# Altium schematic sheet GNSS_A.SchDoc
size A4; SheetNumber: 3; SheetTotal: 7
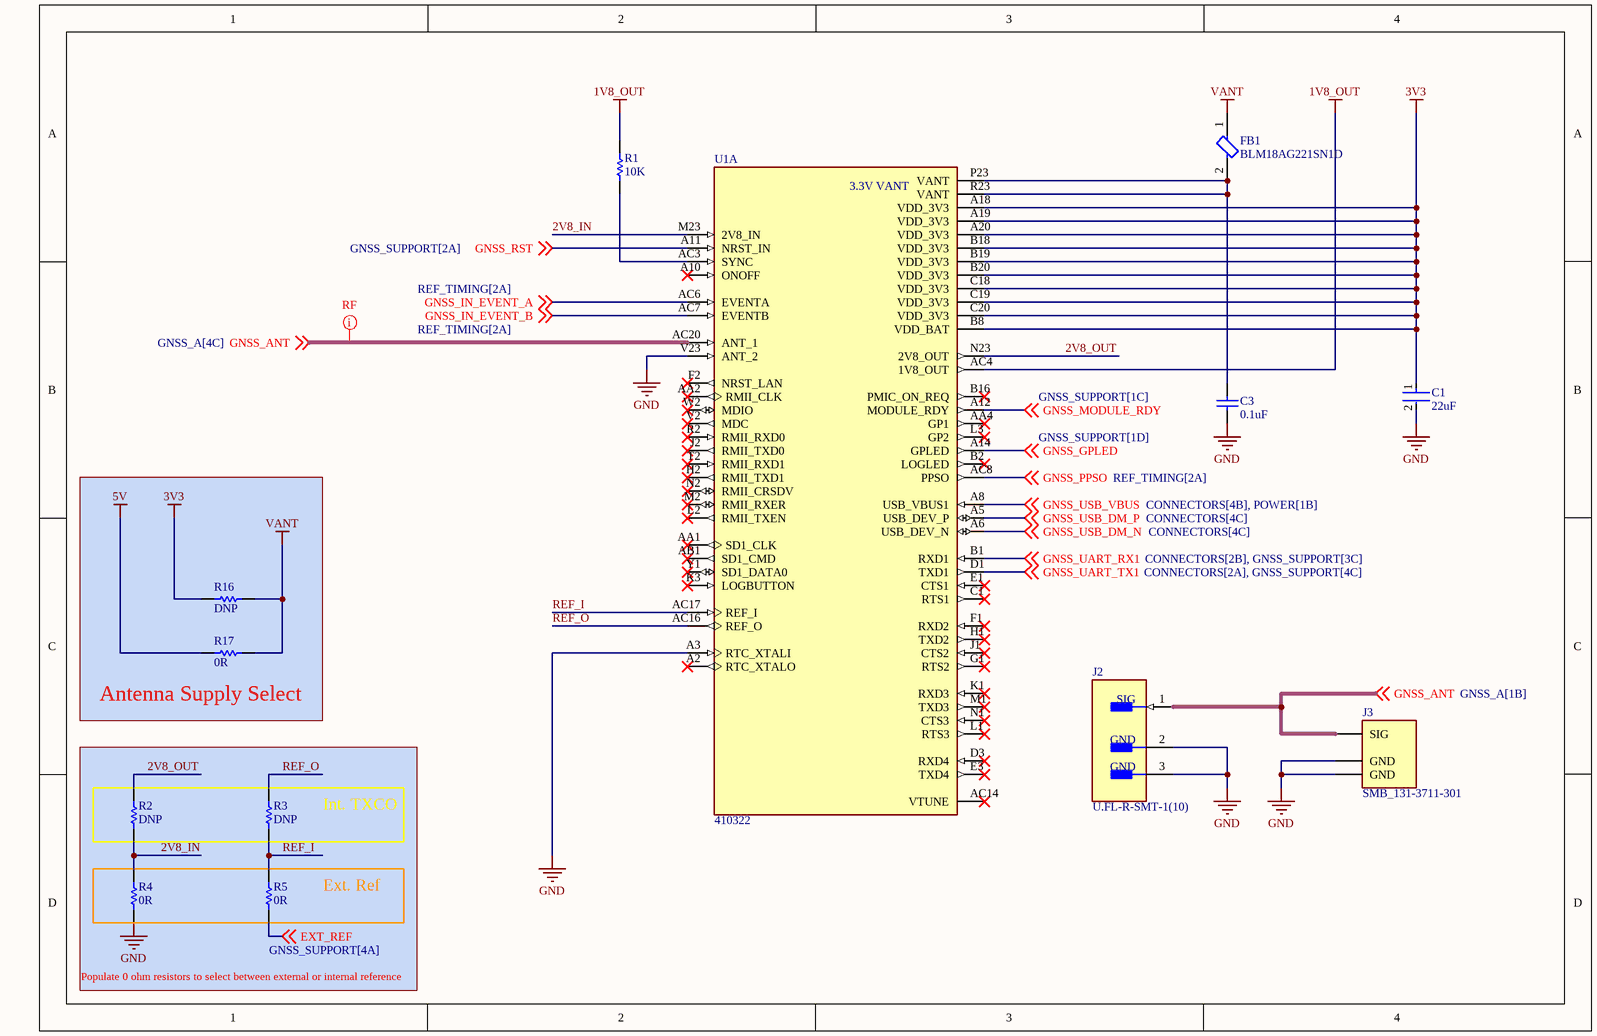
[diagram p0: GNSS_A.SchDoc]

## Parts
C1  22uF  [FP-CL10-IPC_B]
C3  0.1uF  [CAPC1005X56X25LL10T15]
FB1  BLM18AG221SN1D  [FP-BLM18-0_15-t0_8-IPC_A]
J2  U.FL-R-SMT-1(10)  [FP-U_FL-R-SMT-1_10-MFG]
J3  SMB_131-3711-301  [SMB_131-3711-301]
R1  10K  [RESC1005X40X25LL05T10]
R2  DNP  [RESC1005X40X25NL05T10]
R3  DNP  [RESC1005X40X25NL05T10]
R4  0R  [RESC1005X40X25NL05T10]
R5  0R  [RESC1005X40X25NL05T10]
R16  DNP  [RESC1005X40X25NL05T10]
R17  0R  [RESC1005X40X25NL05T10]
U1  410322  [LGA239C127P23X23_3100X3100X417N]  (part A of 3)

## Blocks framed on the sheet
Antenna Supply Select: R16 R17
Int. TXCO: R2 R3
Ext. Ref: R4 R5

## Nets
1V8_OUT: R1.2 U1.AC4(1V8_OUT)
3V3: C1.1 R16.1 U1.A18(VDD_3V3) U1.A19(VDD_3V3) U1.A20(VDD_3V3) U1.B8(VDD_BAT) U1.B18(VDD_3V3) U1.B19(VDD_3V3) U1.B20(VDD_3V3) U1.C18(VDD_3V3) U1.C19(VDD_3V3) U1.C20(VDD_3V3)
5V: R17.1
GND: C1.2 C3.1 J2.2(GND) J2.3(GND) J3.2(GND) J3.3(GND) R4.2 U1.A3(RTC_XTALI) U1.V23(ANT_2)
VANT: FB1.1 R16.2 R17.2
2V8_IN: R2.2 R4.1 U1.M23(2V8_IN)
2V8_OUT: R2.1 U1.N23(2V8_OUT)
EXT_REF: R5.2 ; off-sheet EXT_REF
GNSS_ANT: J2.1(SIG) J3.1(SIG) U1.AC20(ANT_1) ; off-sheet GNSS_ANT
GNSS_GPLED: U1.A14(GPLED) ; off-sheet GNSS_GPLED
GNSS_IN_EVENT_A: U1.AC6(EVENTA) ; off-sheet GNSS_IN_EVENT_A
GNSS_IN_EVENT_B: U1.AC7(EVENTB) ; off-sheet GNSS_IN_EVENT_B
GNSS_MODULE_RDY: U1.A12(MODULE_RDY) ; off-sheet GNSS_MODULE_RDY
GNSS_PPSO: U1.AC8(PPSO) ; off-sheet GNSS_PPSO
GNSS_RST: U1.A11(NRST_IN) ; off-sheet GNSS_RST
GNSS_UART_RX1: U1.B1(RXD1) ; off-sheet GNSS_UART_RX1
GNSS_UART_TX1: U1.D1(TXD1) ; off-sheet GNSS_UART_TX1
GNSS_USB_DM_N: U1.A6(USB_DEV_N) ; off-sheet GNSS_USB_DM_N
GNSS_USB_DM_P: U1.A5(USB_DEV_P) ; off-sheet GNSS_USB_DM_P
GNSS_USB_VBUS: U1.A8(USB_VBUS1) ; off-sheet GNSS_USB_VBUS
REF_I: R3.2 R5.1 U1.AC17(REF_I)
REF_O: R3.1 U1.AC16(REF_O)
NetC3_2: C3.2 FB1.2 U1.P23(VANT) U1.R23(VANT)
NetR1_1: R1.1 U1.AC3(SYNC)

Not connected (* = marked no-connect by the designer): U1 A2(RTC_XTALO)* A10(ONOFF)* AA1(SD1_CLK)* AA2(RMII_CLK)* AA4(GP1)* AB1(SD1_CMD)* AC14(VTUNE)* B2(LOGLED)* B16(PMIC_ON_REQ)* C1(RTS1)* D3(RXD4)* E1(CTS1)* E3(TXD4)* F1(RXD2)* F2(NRST_LAN)* G1(RTS2)* H1(TXD2)* H2(RMII_TXD1)* J1(CTS2)* J2(RMII_TXD0)* K1(RXD3)* K3(LOGBUTTON)* L1(RTS3)* L2(RMII_TXEN)* L3(GP2)* M1(TXD3)* M2(RMII_RXER)* N1(CTS3)* N2(RMII_CRSDV)* R2(RMII_RXD0)* T2(RMII_RXD1)* V2(MDC)* W2(MDIO)* Y1(SD1_DATA0)*

## Layout directives
net class RF: GNSS_ANT

## Notes on the sheet
- (near U1) 3.3V VANT
- Populate 0 ohm resistors to select between external or internal reference

## Library data of the parts
C1 = CMP-13271-003290-1: Cap Ceramic 22uF 10V X5R ±20% Pad SMD 0603 +85°C T/R; Max Operating Temperature: 85°C; Packaging: Tape and Reel; Mount: Surface Mount; Width: 0.031inch; Length: 0.063inch; Min Operating Temperature: -55°C; Voltage Rating: 10V; Case/Package: 0603; Thickness: 0.037inch; Case Code (Metric): 1608; Tolerance: 20%; Case Code (Imperial): 0603; Capacitance: 22uF
C3 = CMP-2008-02743-1: Manufacturer: AVX Interconnect / Elco; Part Number: 04026D104KAT2A
FB1 = CMP-0686-00445-3: Chip Ferrite Bead, 0603, 220Ω @ 100MHz, 0.25Ω, 25%, 700mA; DC Current: 500mA; DC Resistance-Max: 250mR; Shielding: Unshielded; Material: Steel; Impedance: 220R; Number of Lines: 1; Max Operating Temperature: 125°C; Military Standard: Not; Min Operating Temperature: -55°C; Max DC Current: 500mA; Case/Package: 0603; Termination: SMD/SMT; Current Rating: 500mA; REACH SVHC: No SVHC; Depth: 0.8mm; Number of Pins: 2; Radiation Hardening: No; Length: 1.6mm; Packaging: Tape and Reel; Test Frequency: 100MHz; Series: BLM18A; Package Quantity: 1; Tolerance: 25%; Case Code (Imperial): 0603; DC Resistance (DCR): 250mR; Height: 0.8mm; Lead Free: Lead Free; Width: 0.8mm; Case Code (Metric): 1608; RoHS Compliant: Yes; Frequency: 100MHz; Core Material: Ferrite; Number of Circuits: 1; Max Current Rating: 500mA
J2 = CMP-2000-05152-3: CONN U.FL RCPT STR 50 OHM SMD; Max Frequency: 6GHz; Connector Type: Coaxial; Body Plating: Silver; Body Material: Bronze; Impedance: 50R; Dielectric Material: Polymer; Insulation Resistance: 500MR; Gender: Male; Packaging: Cut Tape; Length: 3mm; Package Quantity: 2500; Termination: Solder; Lead Free: Lead Free; Series: U.FL; Min Operating Temperature: -40°C; Fastening Type: Snap; Contact Material: Brass; Orientation: Straight; Wire/Cable Type: Coaxial; Frequency: 6GHz; Contact Plating: Gold; Depth: 3.1mm; Weight: 0.001764oz; Max Operating Temperature: 90°C; Radiation Hardening: No; REACH SVHC: No SVHC; Mount: Surface Mount; Housing Color: Beige
J3 = SMB_131-3711-301: Rf Coaxial Board Mount Connector; Manufacturer: Bel Cinch; Body Material: Brass; Plating: Nickel; Body Plating: Gold; Dielectric Material: PTFE; Impedance: 50R; Voltage Rating: 335V; Gender: Female; Frequency: 4Hz; Connector Type: SMB,Male Pin; Max Frequency: 4GHz; Polarity: Reverse; Operating Frequency: 0 to 4 Hz to GHz; Supplier 1: Digi-Key; Manufacturer Part Number: 131-3711-301; RoHS: Yes; Category: RF / Coaxial Connectors; Stock 1: 475; Pricing 1: 1=7.75000, 10=7.00900, 25=6.62160, 50=6.46000, 100=6.13700, 250=5.49100, 500=5.16800, 1000=4.52200 (USD); Mount: Surface Mount; Case/Package: SMA; Contact Material: Brass; Contact Plating: Gold,Nickel; Housing Color: Gold; Shell Plating: Nickel; Center Contact Plating: Gold; Min Operating Temperature: -65°C; Max Operating Temperature: 165°C; Package Quantity: 25; Packaging: Bulk; Fastening Type: SNAP-ON; Termination: Solder; Orientation: Right Angle; ComponentLink1URL: http://www.mouser.com/Search/include/RoHSCompliant.aspx?qs=sxnx5FoGSWlI%252bs7K%252boh9Yg%3d%3d&src-supplier=Mouser; ComponentLink1Description: http://www.mouser.com/Search/include/RoHSCompliant.aspx?qs=sxnx5FoGSWlI%252bs7K%252boh9Yg%3d%3d&src-supplier=Mouser; ComponentLink2URL: http://www.mouser.com/Search/include/RoHSCompliant.aspx?qs=BzWiDxlKIe%2fRhe5ZDRBb2Q%3d%3d&src-supplier=Mouser; ComponentLink2Description: http://www.mouser.com/Search/include/RoHSCompliant.aspx?qs=BzWiDxlKIe%2fRhe5ZDRBb2Q%3d%3d&src-supplier=Mouser; ComponentLink3URL: http://www.onlinecomponents.com/datasheet/1313711301.aspx?p=11276490&src-supplier=Onlinecomponents.com; ComponentLink3Description: http://www.onlinecomponents.com/datasheet/1313711301.aspx?p=11276490&src-supplier=Onlinecomponents.com; ComponentLink4URL: http://www.mouser.com/Search/include/RoHSCompliant.aspx?qs=sxnx5FoGSWlgU0HI%252bkNgTA%3d%3d&src-supplier=Mouser; ComponentLink4Description: http://www.mouser.com/Search/include/RoHSCompliant.aspx?qs=sxnx5FoGSWlgU0HI%252bkNgTA%3d%3d&src-supplier=Mouser; ComponentLink5URL: http://www.mouser.com/Search/include/RoHSCompliant.aspx?qs=p2XSgoD%252b2ikka7OcbAcBow%3d%3d&src-supplier=Mouser; ComponentLink5Description: http://www.mouser.com/Search/include/RoHSCompliant.aspx?qs=p2XSgoD%252b2ikka7OcbAcBow%3d%3d&src-supplier=Mouser; ComponentLink6URL: http://www.mouser.com/Search/include/RoHSCompliant.aspx?qs=CoHYZihNMM5AOHZHjTCMkA%3d%3d&src-supplier=Mouser; ComponentLink6Description: http://www.mouser.com/Search/include/RoHSCompliant.aspx?qs=CoHYZihNMM5AOHZHjTCMkA%3d%3d&src-supplier=Mouser; ComponentLink7URL: http://www.mouser.com/Search/include/RoHSCompliant.aspx?qs=hJAXt0VUbWsyDbF0CdNvSg%3d%3d&src-supplier=Mouser; ComponentLink7Description: http://www.mouser.com/Search/include/RoHSCompliant.aspx?qs=hJAXt0VUbWsyDbF0CdNvSg%3d%3d&src-supplier=Mouser; Supplier Part Number 1: J10507-ND
R1 = CMP-2002-07353-1: Part Number: RC0402FR-0710KL; Manufacturer: Yageo / Phycomp
R2-R5 R16 R17 = CMP-1011-00001-2: Manufacturer: Yageo / Phycomp; Part Number: RC0402JR-070RL
U1 = 410322: mosaicâ„¢-X5 RF Receiver BeiDou, Galileo, GLONASS, GNSS, GPS; MF: Septentrio Inc.; Value: *; Check_prices: https://www.snapeda.com/parts/410322/ept/view-part/?ref=eda; Purchase-URL: https://pricing.snapeda.com/search/part/410322/?ref=eda; Price: None; MP: 410322; SnapEDA_Link: https://www.snapeda.com/parts/410322/ept/view-part/?ref=snap; Availability: In Stock; Package: None